# Altium schematic sheet Analog - Low Speed SE.SchDoc: Analog - Low Speed Single-Ended
size B; DrawnBy: Jasper Yun; SheetNumber: 8; SheetTotal: 11; Competition: SAC 2021; Subteam: Avionics; University: McGill University; Location: Montreal, Quebec; Project: Avionics Project Name; MRT: McGill Rocket Team
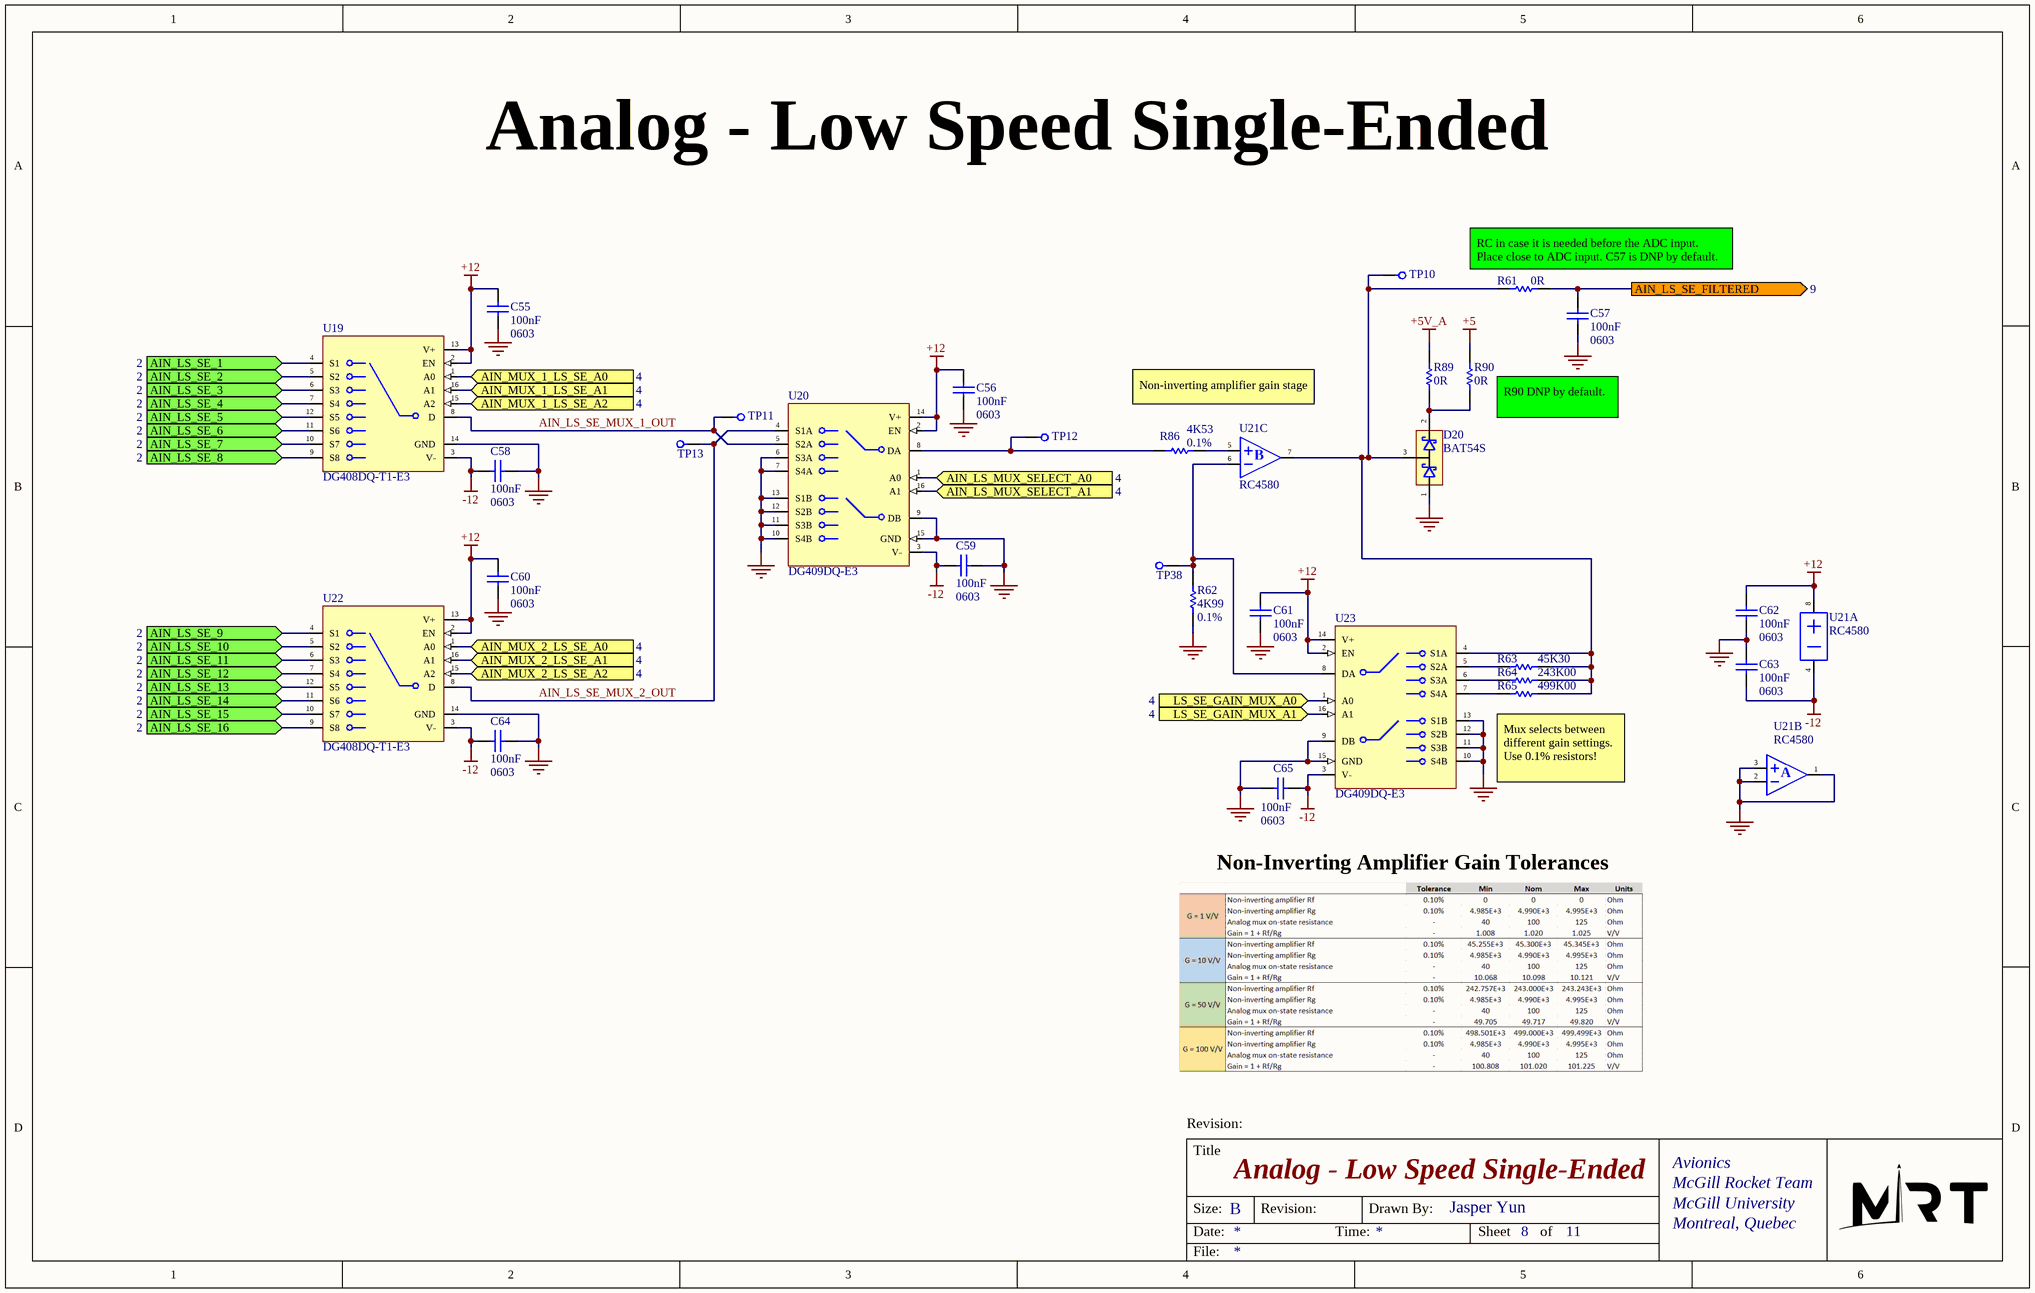
[diagram p0: Analog - Low Speed SE.SchDoc]

## Parts
C55  100nF  value 0603  [0603 CAP SAMSUNG CL10C]
C56  100nF  value 0603  [0603 CAP SAMSUNG CL10C]
C57  100nF  value 0603  [0603 CAP SAMSUNG CL10C]
C58  100nF  value 0603  [0603 CAP SAMSUNG CL10C]
C59  100nF  value 0603  [0603 CAP SAMSUNG CL10C]
C60  100nF  value 0603  [0603 CAP SAMSUNG CL10C]
C61  100nF  value 0603  [0603 CAP SAMSUNG CL10C]
C62  100nF  value 0603  [0603 CAP SAMSUNG CL10C]
C63  100nF  value 0603  [0603 CAP SAMSUNG CL10C]
C64  100nF  value 0603  [0603 CAP SAMSUNG CL10C]
C65  100nF  value 0603  [0603 CAP SAMSUNG CL10C]
D20  BAT54S  [SOT23-3]
R61  0R  [0603 RES]
R62  4K99  value 0.1%  [0603 RES]
R63  45K30  [0603 RES]
R64  243K00  [0603 RES]
R65  499K00  [0603 RES]
R86  4K53  value 0.1%  [0603 RES]
R89  0R  [0603 RES]
R90  0R  [0603 RES]
TP10  Test Point  [Test Point Keystone 5015]  (value not drawn)
TP11  Test Point  [TEST POINT SMD PAD]  (value not drawn)  (no BOM)
TP12  Test Point  [Test Point Keystone 5015]  (value not drawn)
TP13  Test Point  [TEST POINT SMD PAD]  (value not drawn)  (no BOM)
TP38  Test Point  [Test Point Keystone 5015]  (value not drawn)
U19  DG408DQ-T1-E3  [TSSOP-16]
U20  DG409DQ-E3  [TSSOP-16]
U21  RC4580  [SOIC-8]  (parts A,B,C of 3)
U22  DG408DQ-T1-E3  [TSSOP-16]
U23  DG409DQ-E3  [TSSOP-16]

## Ports
AIN_LS_MUX_SELECT_A0 (in, see 4), AIN_LS_MUX_SELECT_A1 (in, see 4), AIN_LS_SE_1 (in, see 2), AIN_LS_SE_2 (in, see 2), AIN_LS_SE_3 (in, see 2), AIN_LS_SE_4 (in, see 2), AIN_LS_SE_5 (in, see 2), AIN_LS_SE_6 (in, see 2), AIN_LS_SE_7 (in, see 2), AIN_LS_SE_8 (in, see 2), AIN_LS_SE_9 (in, see 2), AIN_LS_SE_10 (in, see 2), AIN_LS_SE_11 (in, see 2), AIN_LS_SE_12 (in, see 2), AIN_LS_SE_13 (in, see 2), AIN_LS_SE_14 (in, see 2), AIN_LS_SE_15 (in, see 2), AIN_LS_SE_16 (in, see 2), AIN_LS_SE_FILTERED (out, see 9), AIN_MUX_1_LS_SE_A0 (in, see 4), AIN_MUX_1_LS_SE_A1 (in, see 4), AIN_MUX_1_LS_SE_A2 (in, see 4), AIN_MUX_2_LS_SE_A0 (in, see 4), AIN_MUX_2_LS_SE_A1 (in, see 4), AIN_MUX_2_LS_SE_A2 (in, see 4), LS_SE_GAIN_MUX_A0 (in, see 4), LS_SE_GAIN_MUX_A1 (in, see 4)

## Nets
+5: R90.1
+5V_A: R89.1
+12: C55.2 C56.2 C60.2 C61.2 C62.2 U19.2(EN) U19.13(V+) U20.2(EN) U20.14(V+) U21.8(VCC+) U22.2(EN) U22.13(V+) U23.2(EN) U23.14(V+)
-12: C58.2 C59.2 C63.1 C64.2 C65.2 U19.3(V-) U20.3(V-) U21.4(VCC-) U22.3(V-) U23.3(V-)
GND: C55.1 C56.1 C57.1 C58.1 C59.1 C60.1 C61.1 C62.1 C63.2 C64.1 C65.1 D20.1 R62.1 U19.14(GND) U20.6(S3A) U20.7(S4A) U20.9(DB) U20.10(S4B) U20.11(S3B) U20.12(S2B) U20.13(S1B) U20.15(GND) U21.1 U21.2 U21.3 U22.14(GND) U23.9(DB) U23.10(S4B) U23.11(S3B) U23.12(S2B) U23.13(S1B) U23.15(GND)
AIN_LS_MUX_SELECT_A0: U20.1(A0) ; port AIN_LS_MUX_SELECT_A0
AIN_LS_MUX_SELECT_A1: U20.16(A1) ; port AIN_LS_MUX_SELECT_A1
AIN_LS_SE_1: U19.4(S1) ; port AIN_LS_SE_1
AIN_LS_SE_2: U19.5(S2) ; port AIN_LS_SE_2
AIN_LS_SE_3: U19.6(S3) ; port AIN_LS_SE_3
AIN_LS_SE_4: U19.7(S4) ; port AIN_LS_SE_4
AIN_LS_SE_5: U19.12(S5) ; port AIN_LS_SE_5
AIN_LS_SE_6: U19.11(S6) ; port AIN_LS_SE_6
AIN_LS_SE_7: U19.10(S7) ; port AIN_LS_SE_7
AIN_LS_SE_8: U19.9(S8) ; port AIN_LS_SE_8
AIN_LS_SE_9: U22.4(S1) ; port AIN_LS_SE_9
AIN_LS_SE_10: U22.5(S2) ; port AIN_LS_SE_10
AIN_LS_SE_11: U22.6(S3) ; port AIN_LS_SE_11
AIN_LS_SE_12: U22.7(S4) ; port AIN_LS_SE_12
AIN_LS_SE_13: U22.12(S5) ; port AIN_LS_SE_13
AIN_LS_SE_14: U22.11(S6) ; port AIN_LS_SE_14
AIN_LS_SE_15: U22.10(S7) ; port AIN_LS_SE_15
AIN_LS_SE_16: U22.9(S8) ; port AIN_LS_SE_16
AIN_LS_SE_FILTERED: C57.2 R61.1 ; port AIN_LS_SE_FILTERED
AIN_LS_SE_MUX_1_OUT: TP11.1 U19.8(D) U20.5(S2A)
AIN_LS_SE_MUX_2_OUT: TP13.1 U20.4(S1A) U22.8(D)
AIN_MUX_1_LS_SE_A0: U19.1(A0) ; port AIN_MUX_1_LS_SE_A0
AIN_MUX_1_LS_SE_A1: U19.16(A1) ; port AIN_MUX_1_LS_SE_A1
AIN_MUX_1_LS_SE_A2: U19.15(A2) ; port AIN_MUX_1_LS_SE_A2
AIN_MUX_2_LS_SE_A0: U22.1(A0) ; port AIN_MUX_2_LS_SE_A0
AIN_MUX_2_LS_SE_A1: U22.16(A1) ; port AIN_MUX_2_LS_SE_A1
AIN_MUX_2_LS_SE_A2: U22.15(A2) ; port AIN_MUX_2_LS_SE_A2
LS_SE_GAIN_MUX_A0: U23.1(A0) ; port LS_SE_GAIN_MUX_A0
LS_SE_GAIN_MUX_A1: U23.16(A1) ; port LS_SE_GAIN_MUX_A1
NetD20_2: D20.2 R89.2 R90.2
NetD20_3: D20.3 R61.2 R63.1 R64.1 R65.1 TP10.1 U21.7 U23.4(S1A)
NetR62_2: R62.2 TP38.1 U21.6 U23.8(DA)
NetR63_2: R63.2 U23.5(S2A)
NetR64_2: R64.2 U23.6(S3A)
NetR65_2: R65.2 U23.7(S4A)
NetR86_1: R86.1 U21.5
NetR86_2: R86.2 TP12.1 U20.8(DA)

## Notes on the sheet
- (near R61) RC in case it is needed before the ADC input. Place close to ADC input. C57 is DNP by default.
- Non-inverting amplifier gain stage
- (near R90) R90 DNP by default.
- Mux selects between different gain settings.
  Use 0.1% resistors!
- Non-Inverting Amplifier Gain Tolerances
- Title
- Size:
- Date:
- B
- Revision:
- Time:
- Drawn By:
- Sheet
- of
- File:
- (in symbol OP AMP RC4580, part B) A
- (in symbol OP AMP RC4580, part C) B

## Library data of the parts
C55-C65 = Cap: Capacitor; Published: 8-Jun-2000; LatestRevisionDate: 17-Jul-2002; LatestRevisionNote: Re-released for DXP Platform.; PackageReference: RAD-0.3; Publisher: Altium Limited; PackageDescription: Radial Cap, Thru-Hole; 2 Leads; 0.3 in Pin Spacing
D20 = Schottky Diode Array BAT54S: Rectifier Diode Small Signal Schottky 40V 0.3A 5ns 3-Pin SOT-23 T/R; Manufacturer: STMicroelectronics; Manufacturer Part Number: BAT54SFILM; Forward Current: 300mA; Peak Non-Repetitive Surge Current: 1A; Forward Voltage: 900mV; Max Reverse Current: 100uA; Max Reverse Leakage Current: 1uA; Element Configuration: Single; Voltage Rating (DC): 30V; Supplier 1: Digi-Key; RoHS: Yes; Category: Rectifier Diodes; Stock 1: 2760; Pricing 1: 1=0.34000, 10=0.27800, 100=0.14730, 500=0.09694, 1000=0.06592 (USD); Mount: Surface Mount; Case/Package: SOT-23; Number of Pins: 3; Weight: 0.1lb; Min Operating Temperature: -40°C; Max Operating Temperature: 150°C; Reverse Recovery Time: 5ns; Max Repetitive Reverse Voltage (Vrrm): 40V; Packaging: Tape and Reel; Package Quantity: 3000; Average Rectified Current: 300mA; Max Forward Surge Current (Ifsm): 1A; Max Reverse Voltage (DC): 40V; Max Surge Current: 1A; Recovery Time: 5ns; Termination: SMD/SMT; Current Rating: 300mA; Length: 2.9mm; Width: 3.05mm; Height: 0.95mm; Radiation Hardening: No; REACH SVHC: No SVHC; RoHS Compliant: Yes; Lead Free: Lead Free; ComponentLink1URL: https://datasheet.ciiva.com/1200/1689724-1200683.pdf?src-supplier=Farnell; ComponentLink1Description: https://datasheet.ciiva.com/1200/1689724-1200683.pdf?src-supplier=Farnell; ComponentLink2URL: https://datasheet.ciiva.com/1177/1689724-1177974.pdf?src-supplier=Element14; ComponentLink2Description: https://datasheet.ciiva.com/1177/1689724-1177974.pdf?src-supplier=Element14; ComponentLink3URL: https://datasheet.ciiva.com/1200/cd00001322-1200682.pdf?src-supplier=Farnell; ComponentLink3Description: https://datasheet.ciiva.com/1200/cd00001322-1200682.pdf?src-supplier=Farnell; ComponentLink4URL: https://datasheet.ciiva.com/14168/cd00001322-14168028.pdf?src-supplier=Distrelec; ComponentLink4Description: https://datasheet.ciiva.com/14168/cd00001322-14168028.pdf?src-supplier=Distrelec; ComponentLink5URL: https://datasheet.ciiva.com/905/cd00001322-905882.pdf?src-supplier=Digi-Key; ComponentLink5Description: https://datasheet.ciiva.com/905/cd00001322-905882.pdf?src-supplier=Digi-Key; ComponentLink6URL: https://datasheet.ciiva.com/905/cd00001322-905881.pdf?src-supplier=Digi-Key; ComponentLink6Description: https://datasheet.ciiva.com/905/cd00001322-905881.pdf?src-supplier=Digi-Key; ComponentLink7URL: https://datasheet.ciiva.com/905/cd00001322-905883.pdf?src-supplier=Digi-Key; ComponentLink7Description: https://datasheet.ciiva.com/905/cd00001322-905883.pdf?src-supplier=Digi-Key; ComponentLink8URL: https://datasheet.ciiva.com/1177/1689724-1177973.pdf?src-supplier=Element14; ComponentLink8Description: https://datasheet.ciiva.com/1177/1689724-1177973.pdf?src-supplier=Element14; Supplier Part Number 1: 497-2522-1-ND
R61 R63-R65 R89 R90 = Res1: Resistor; Value: 1%; Published: 8-Jun-2000; LatestRevisionDate: 17-Jul-2002; LatestRevisionNote: Re-released for DXP Platform.; PackageReference: AXIAL-0.3; Publisher: Altium Limited; PackageDescription: Axial Device, Thru-Hole; 2 Leads; 0.3 in Pin Spacing
R62 R86 = Res1: Resistor; Published: 8-Jun-2000; LatestRevisionDate: 17-Jul-2002; LatestRevisionNote: Re-released for DXP Platform.; PackageReference: AXIAL-0.3; Publisher: Altium Limited; PackageDescription: Axial Device, Thru-Hole; 2 Leads; 0.3 in Pin Spacing
TP10-TP13 TP38 = Test Point: Keystone 5015 Test point
U19 U22 = Analog Mux DG408DQ-T1-E3: DG408DQ-T1-E3; Multiplexer Single 8: 1; 15 V; 18 V; 24 V; 28 V; 16-Pin TSSOP; Manufacturer: Vishay Siliconix; Min Supply Voltage: 13V; Max Supply Voltage: 44V; Number of Inputs: 8; Number of Outputs: 1; Operating Supply Voltage: 36V; Propagation Delay: 160ns; Max Power Dissipation: 600mW; Min Dual Supply Voltage: 5V; Max Dual Supply Voltage: 20V; Dual Supply Voltage: 15V; On-State Resistance: 90R; Turn-On Delay Time: 150ns; Max Supply Current: 500uA; Operating Supply Current: 1uA; Supply Type: Single,Dual; Nominal Supply Current: 10uA; High Level Output Current: 30mA; Supplier 1: RSComponents; Manufacturer Part Number: DG408DQ-T1-E3; RoHS: Yes; Category: Decoders and Multiplexers; Stock 1: 2985; Pricing 1: 5=2.69000, 50=2.02000, 250=1.57000 (GBP); Mount: Surface Mount; Case/Package: TSSOP; Number of Pins: 16; Weight: 0.006102oz; Contact Plating: Tin,Matte; Min Operating Temperature: -40°C; Max Operating Temperature: 85°C; Packaging: Tape and Reel; Number of Channels: 8; Package Quantity: 1; Turn-Off Delay Time: 150ns; Logic Function: Multiplexer; Power Dissipation: 600mW; Number of Circuits: 1; Series: -; Supply Current: 10uA; Length: 5.07mm; Width: 4.4mm; Height: 0.92mm; Radiation Hardening: No; Reach SVHC Compliant: Unknown; Lead Free: Lead Free; RoHS Compliant: Yes; ComponentLink1URL: https://datasheet.ciiva.com/15127/getdatasheetpartid-99309-15127097.pdf?src-supplier=Verical; ComponentLink1Description: https://datasheet.ciiva.com/15127/getdatasheetpartid-99309-15127097.pdf?src-supplier=Verical; ComponentLink2URL: https://datasheet.ciiva.com/11499/dg408-11499135.pdf?src-supplier=Avnet; ComponentLink2Description: https://datasheet.ciiva.com/11499/dg408-11499135.pdf?src-supplier=Avnet; ComponentLink3URL: https://datasheet.ciiva.com/1666/dg408-1666717.pdf?src-supplier=Digi-Key; ComponentLink3Description: https://datasheet.ciiva.com/1666/dg408-1666717.pdf?src-supplier=Digi-Key; ComponentLink4URL: https://datasheet.ciiva.com/1666/dg408-1666718.pdf?src-supplier=Digi-Key; ComponentLink4Description: https://datasheet.ciiva.com/1666/dg408-1666718.pdf?src-supplier=Digi-Key; ComponentLink5URL: https://datasheet.ciiva.com/1666/dg408-1666719.pdf?src-supplier=Digi-Key; ComponentLink5Description: https://datasheet.ciiva.com/1666/dg408-1666719.pdf?src-supplier=Digi-Key; Supplier Part Number 1: 2509481281
U20 U23 = Analog Mux DG409DQ-E3: DG409 Series 20 V 8-Ch/Dual 4-Ch High-Performance CMOS Analog Multiplexer; Manufacturer: Vishay Siliconix; Min Supply Voltage: 13V; Max Supply Voltage: 44V; Number of Inputs: 8; Number of Outputs: 2; Number of Channels: 4; Min Dual Supply Voltage: 5V; Max Dual Supply Voltage: 20V; Propagation Delay: 160ns; On-State Resistance: 90R; Operating Supply Current: 1uA; Turn-On Delay Time: 150ns; Max Power Dissipation: 600mW; Max Supply Current: 500uA; Supply Type: Dual,Single; Dual Supply Voltage: 15V; Operating Supply Voltage: 36V; Supplier 1: Mouser; Manufacturer Part Number: DG409DQ-E3; RoHS: Yes; Category: Decoders and Multiplexers; Stock 1: 4584; Pricing 1: 1=4.36000, 10=3.91000, 50=3.70000, 100=3.20000, 1000=2.73000, 10000=2.40000 (USD); Mount: Surface Mount; Case/Package: TSSOP; Number of Pins: 16; Weight: 0.006102oz; Min Operating Temperature: -40°C; Max Operating Temperature: 85°C; Package Quantity: 360; Packaging: Rail/Tube; Logic Function: Multiplexer; Turn-Off Delay Time: 150ns; Power Dissipation: 600mW; Series: -; Length: 5.07mm; Width: 4.4mm; Height: 0.92mm; Radiation Hardening: No; Lead Free: Lead Free; RoHS Compliant: Yes; ComponentLink1URL: https://datasheet.ciiva.com/1677/dg408-1677556.pdf?src-supplier=Digi-Key; ComponentLink1Description: https://datasheet.ciiva.com/1677/dg408-1677556.pdf?src-supplier=Digi-Key; ComponentLink2URL: https://datasheet.ciiva.com/2978/dg408-2978747.pdf?src-supplier=Avnet; ComponentLink2Description: https://datasheet.ciiva.com/2978/dg408-2978747.pdf?src-supplier=Avnet; Supplier Part Number 1: 78-DG409DQ-E3
U21 = OP AMP RC4580: 2-channel, 12-MHz, low-noise, low-distortion audio op amp with high output current 8-SOIC -40 to 85; Manufacturer: Texas Instruments; Manufacturer Part Number: RC4580IDR; Min Supply Voltage: 4V; Max Supply Voltage: 32V; Max Dual Supply Voltage: 16V; Min Dual Supply Voltage: 2V; Voltage Gain: 110dB; Common Mode Rejection Ratio: 80dB; Nominal Gain Bandwidth Product: 12MHz; Number of Channels: 2; Slew Rate: 5V/µs; Max I/O Voltage: 3mV; Input Bias Current: 500nA; Operating Supply Current: 6mA; Output Current per Channel: 50mA; Nominal Supply Current: 4.5mA; Dual Supply Voltage: 9V; Load Impedance: 2kR; Supplier 1: Digi-Key; RoHS: Yes; Category: Amplifiers - Op Amps, Buffer, Instrumentation; Stock 1: 3503; Pricing 1: 1=0.46000, 10=0.37400, 25=0.34200, 100=0.25460, 250=0.23072, 500=0.19092, 1000=0.14320 (USD); Case/Package: D; Number of Pins: 8; Weight: 0.002561oz; Contact Plating: Gold; Min Operating Temperature: -40°C; Max Operating Temperature: 85°C; Packaging: Tape and Reel; Package Quantity: 1; Number of Circuits: 2; Gain Bandwidth Product: 12MHz; Input Offset Voltage (Vos): 3mV; Series: -; Supply Current: 4.5mA; Bandwidth: 12MHz; Unity Gain Bandwidth Product: 12MHz; Number of Elements: 2; Technology: BIPOLAR; Radiation Hardening: No; Lead Free: Lead Free; RoHS Compliant: Yes; Reach SVHC Compliant: No SVHC; ComponentLink1URL: https://datasheet.ciiva.com/23806/1716592-23806563.pdf?src-supplier=Newark; ComponentLink1Description: https://datasheet.ciiva.com/23806/1716592-23806563.pdf?src-supplier=Newark; ComponentLink2URL: https://datasheet.ciiva.com/22654/1882301-22654837.pdf?src-supplier=Element14; ComponentLink2Description: https://datasheet.ciiva.com/22654/1882301-22654837.pdf?src-supplier=Element14; ComponentLink3URL: https://datasheet.ciiva.com/46382/1840282-46382300.pdf?src-supplier=Element14; ComponentLink3Description: https://datasheet.ciiva.com/46382/1840282-46382300.pdf?src-supplier=Element14; ComponentLink4URL: https://datasheet.ciiva.com/1796/rc4580-1796261.pdf?src-supplier=Digi-Key; ComponentLink4Description: https://datasheet.ciiva.com/1796/rc4580-1796261.pdf?src-supplier=Digi-Key; ComponentLink5URL: https://datasheet.ciiva.com/1796/rc4580-1796260.pdf?src-supplier=Digi-Key; ComponentLink5Description: https://datasheet.ciiva.com/1796/rc4580-1796260.pdf?src-supplier=Digi-Key; ComponentLink6URL: https://datasheet.ciiva.com/1796/rc4580-1796262.pdf?src-supplier=Digi-Key; ComponentLink6Description: https://datasheet.ciiva.com/1796/rc4580-1796262.pdf?src-supplier=Digi-Key; Supplier Part Number 1: 296-15367-1-ND